# EAGLE design ArduinoLFO_Output_Board (EAGLE 8.7.0)
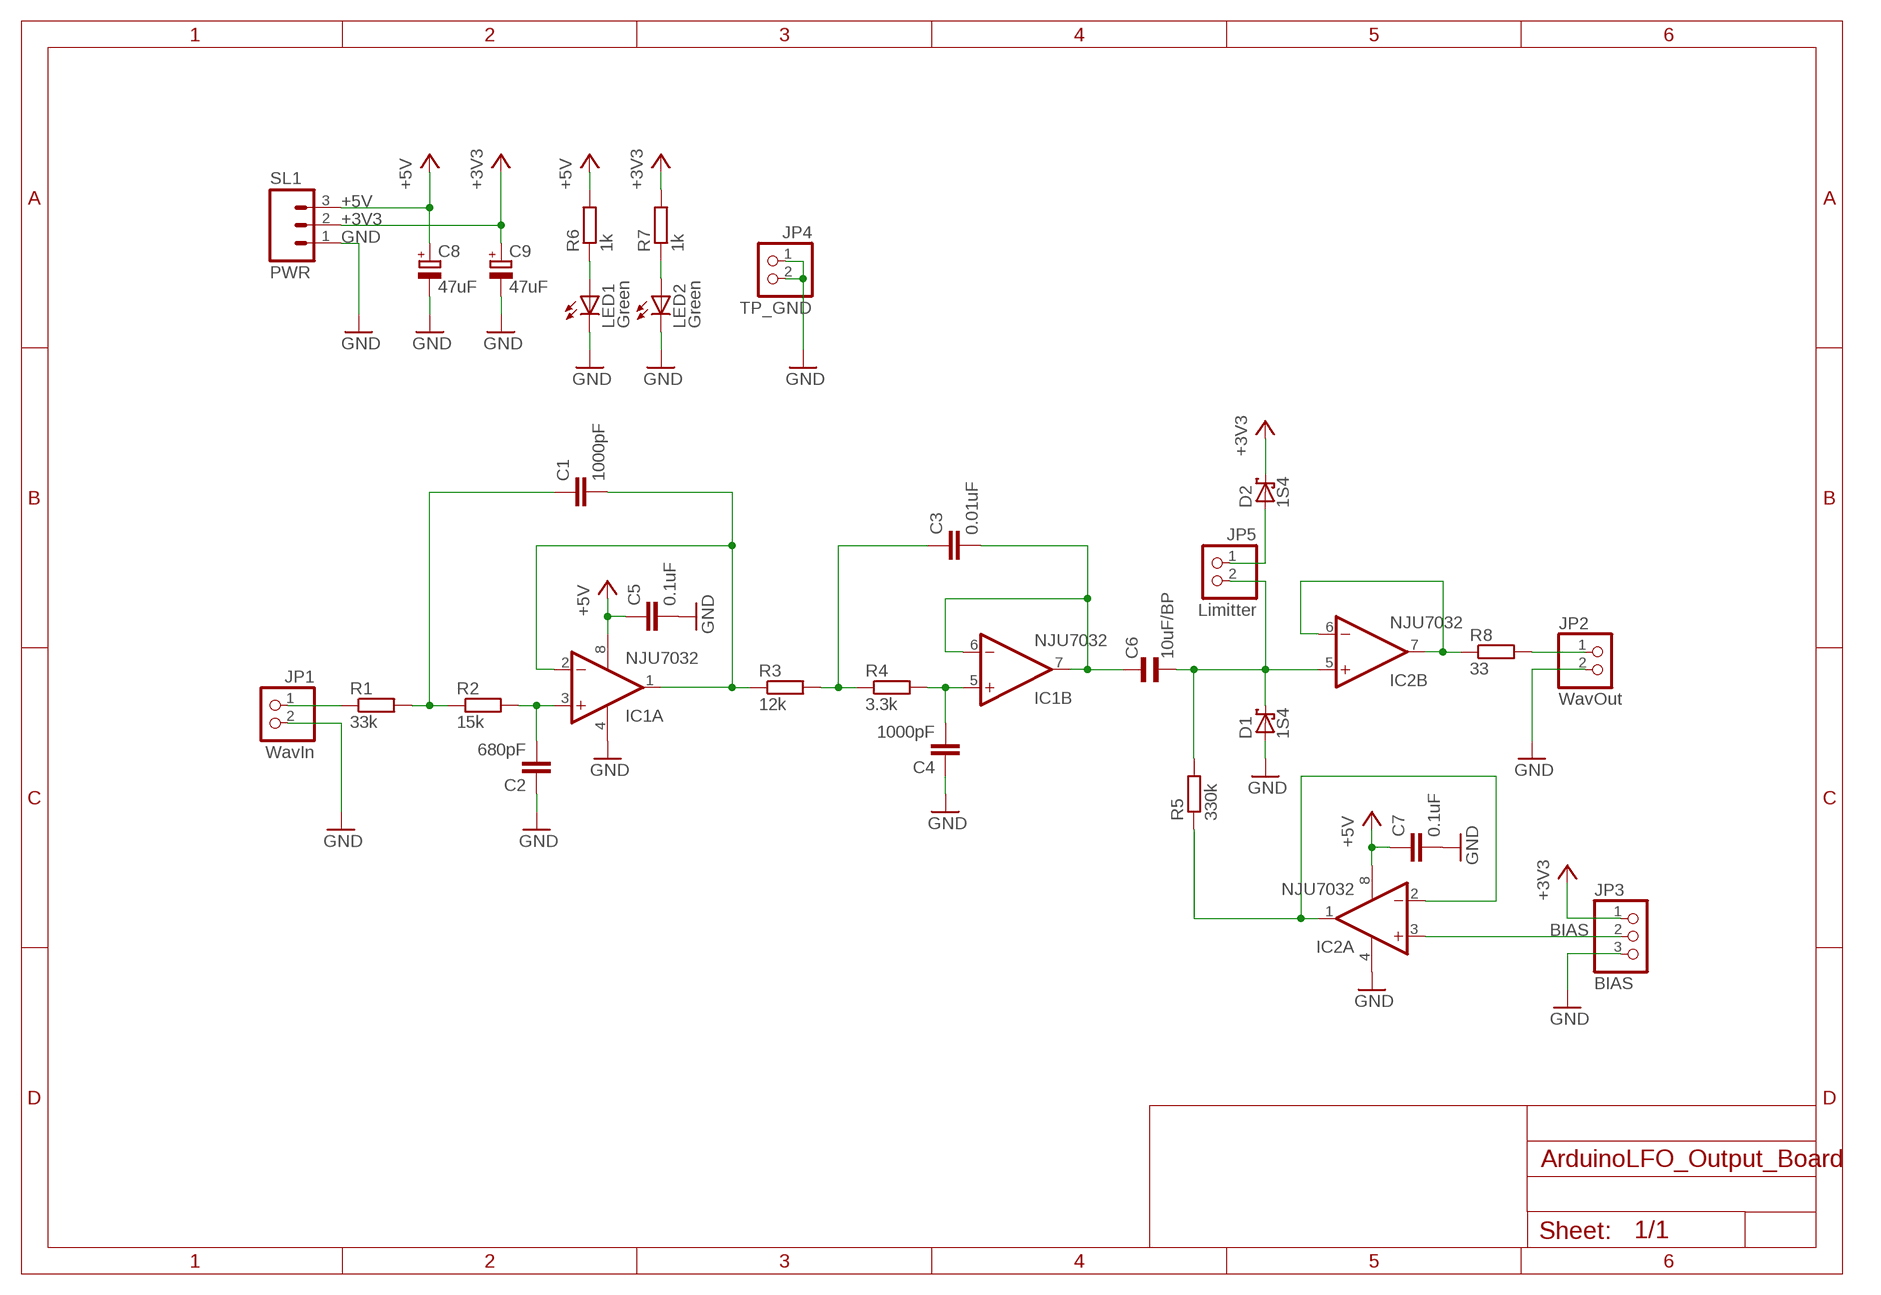
[diagram p0: schematic, sheet 1]

## Parts
C1  1000pF  C-EU050-025X075  [C050-025X075]
C2  680pF  C-EU050-030X075  [C050-030X075]
C3  0.01uF  C-EU050-025X075  [C050-025X075]
C4  1000pF  C-EU050-025X075  [C050-025X075]
C5  0.1uF  C-EU025-024X044  [C025-024X044]
C6  10uF/BP  C_BP-E5-8.5  [E5-8,5]
C7  0.1uF  C-EU025-024X044  [C025-024X044]
C8  47uF  CPOL-EUE2.5-6  [E2,5-6]
C9  47uF  CPOL-EUE2.5-6  [E2,5-6]
D1  1S4  SCHOTTKY-DIODEDO35-7  [DO35-7]
D2  1S4  SCHOTTKY-DIODEDO35-7  [DO35-7]
IC1  NJU7032  LM358N  [DIL08]
IC2  NJU7032  LM358N  [DIL08]
JP1  WavIn  PINHD-1X2  [1X02]
JP2  WavOut  PINHD-1X2  [1X02]
JP3  BIAS  PINHD-1X3  [1X03]
JP4  TP_GND  PINHD-1X2  [1X02]
JP5  Limitter  PINHD-1X2  [1X02]
LED1  Green  LED3MM  [LED3MM]
LED2  Green  LED3MM  [LED3MM]
R1  33k  R-EU_0207/7  [0207/7]
R2  15k  R-EU_0207/7  [0207/7]
R3  12k  R-EU_0207/7  [0207/7]
R4  3.3k  R-EU_0207/7  [0207/7]
R5  330k  R-EU_0207/7  [0207/7]
R6  1k  R-EU_0207/7  [0207/7]
R7  1k  R-EU_0207/7  [0207/7]
R8  33  R-EU_0207/7  [0207/7]
SL1  PWR  AMP-EI-M3  [03PA]

## Nets
+3V3: C9.+ D2.C JP3.1 R7.2 SL1.2
+5V: C5.1 C7.1 C8.+ IC1.8(P:V+) IC2.8(P:V+) R6.2 SL1.3
BIAS: IC2.3(A:+IN) JP3.2
GND: C2.1 C4.1 C5.2 C7.2 C8.- C9.- D1.A IC1.4(P:V-) IC2.4(P:V-) JP1.2 JP2.2 JP3.3 JP4.1 JP4.2 LED1.K(C) LED2.K(C) SL1.1
N$1: JP1.1 R1.1
N$2: C1.1 R1.2 R2.1
N$3: C2.2 IC1.3(A:+IN) R2.2
N$4: C1.2 IC1.1(A:OUT) IC1.2(A:-IN) R3.1
N$5: C3.1 R3.2 R4.1
N$6: C4.2 IC1.5(B:+IN) R4.2
N$7: C3.2 C6.1 IC1.6(B:-IN) IC1.7(B:OUT)
N$8: C6.2 D1.C IC2.5(B:+IN) JP5.2 R5.2
N$9: IC2.6(B:-IN) IC2.7(B:OUT) R8.1
N$10: IC2.1(A:OUT) IC2.2(A:-IN) R5.1
N$11: JP2.1 R8.2
N$12: LED1.A R6.1
N$13: LED2.A R7.1
N$14: D2.A JP5.1

## Library data of the parts
C1-C5 C7 = rcl:C-EU: CAPACITOR, European symbol; SPICEPREFIX: C
C6 = mylib2:C_BP-E5-8.5: Bipolar Capacitor Φ8.5
C8 C9 = rcl:CPOL-EU: POLARIZED CAPACITOR, European symbol; SPICEPREFIX: C
D1 D2 = diode:SCHOTTKY-DIODE: Schottky Diode
IC1 IC2 = linear:LM358: OP AMP also LM158; LM258; LM2904 Source: http://cache.national.com/ds/LM/LM158.pdf
JP1 JP2 JP4 JP5 = pinhead:PINHD-1X2: PIN HEADER
JP3 = pinhead:PINHD-1X3: PIN HEADER
LED1 LED2 = led:LED: LED OSRAM: - CHIPLED LG R971, LG N971, LY N971, LG Q971, LY Q971, LO R971, LY R971 LH N974, LH R974 LS Q976, LO Q976, LY Q976 LO Q996 - Hyper CHIPLED LW Q18S LB Q993, LB Q99A, LB R99A - SideLED LS A670, LO A670, LY A670, LG A670, LP A670 LB A673, LV A673, LT A673, LW A673 LH A674 LY A675 LS A676, LA A676, LO A676, LY A676, LW A676 LS A679, LY A679, LG A679 - Hyper Micro SIDELED® LS Y876, LA Y876, LO Y876, LY Y876 LT Y87S - SmartLED LW L88C, LW L88S LB L89C, LB L89S, LG L890 LS L89K, LO L89K, LY L89K LS L896, LA L896, LO L896, LY L896 - TOPLED LS T670, LO T670, LY T670, LG T670, LP T670 LSG T670, LSP T670, LSY T670, LOP T670, LYG T670 LG T671, LOG T671, LSG T671 LB T673, LV T673, LT T673, LW T673 LH T674 LS T676, LA T676, LO T676, LY T676, LB T676, LH T676, LSB T676, LW T676 LB T67C, LV T67C, LT T67C, LS T67K, LO T67K, LY T67K, LW E67C LS E67B, LA E67B, LO E67B, LY E67B, LB E67C, LV E67C, LT E67C LW T67C LS T679, LY T679, LG T679 LS T770, LO T770, LY T770, LG T770, LP T770 LB T773, LV T773, LT T773, LW T773 LH T774 LS E675, LA E675, LY E675, LS T675 LS T776, LA T776, LO T776, LY T776, LB T776 LHGB T686 LT T68C, LB T68C - Hyper Mini TOPLED® LB M676 - Mini TOPLED Santana® LG M470 LS M47K, LO M47K, LY M47K Source: http://www.osram.convergy.de LUXEON: - LUMILED® LXK2-PW12-R00, LXK2-PW12-S00, LXK2-PW14-U00, LXK2-PW14-V00 LXK2-PM12-R00, LXK2-PM12-S00, LXK2-PM14-U00 LXK2-PE12-Q00, LXK2-PE12-R00, LXK2-PE12-S00, LXK2-PE14-T00, LXK2-PE14-U00 LXK2-PB12-K00, LXK2-PB12-L00, LXK2-PB12-M00, LXK2-PB14-N00, LXK2-PB14-P00, LXK2-PB14-Q00 LXK2-PR12-L00, LXK2-PR12-M00, LXK2-PR14-Q00, LXK2-PR14-R00 LXK2-PD12-Q00, LXK2-PD12-R00, LXK2-PD12-S00 LXK2-PH12-R00, LXK2-PH12-S00 LXK2-PL12-P00, LXK2-PL12-Q00, LXK2-PL12-R00 Source: www.luxeon.com KINGBRIGHT: KA-3528ASYC Source: www.kingbright.com
R1-R8 = rcl:R-EU_: RESISTOR, European symbol; SPICEPREFIX: R
SL1 = mylib2:AMP-EI-M3: AMP EI 3P L型

## Board
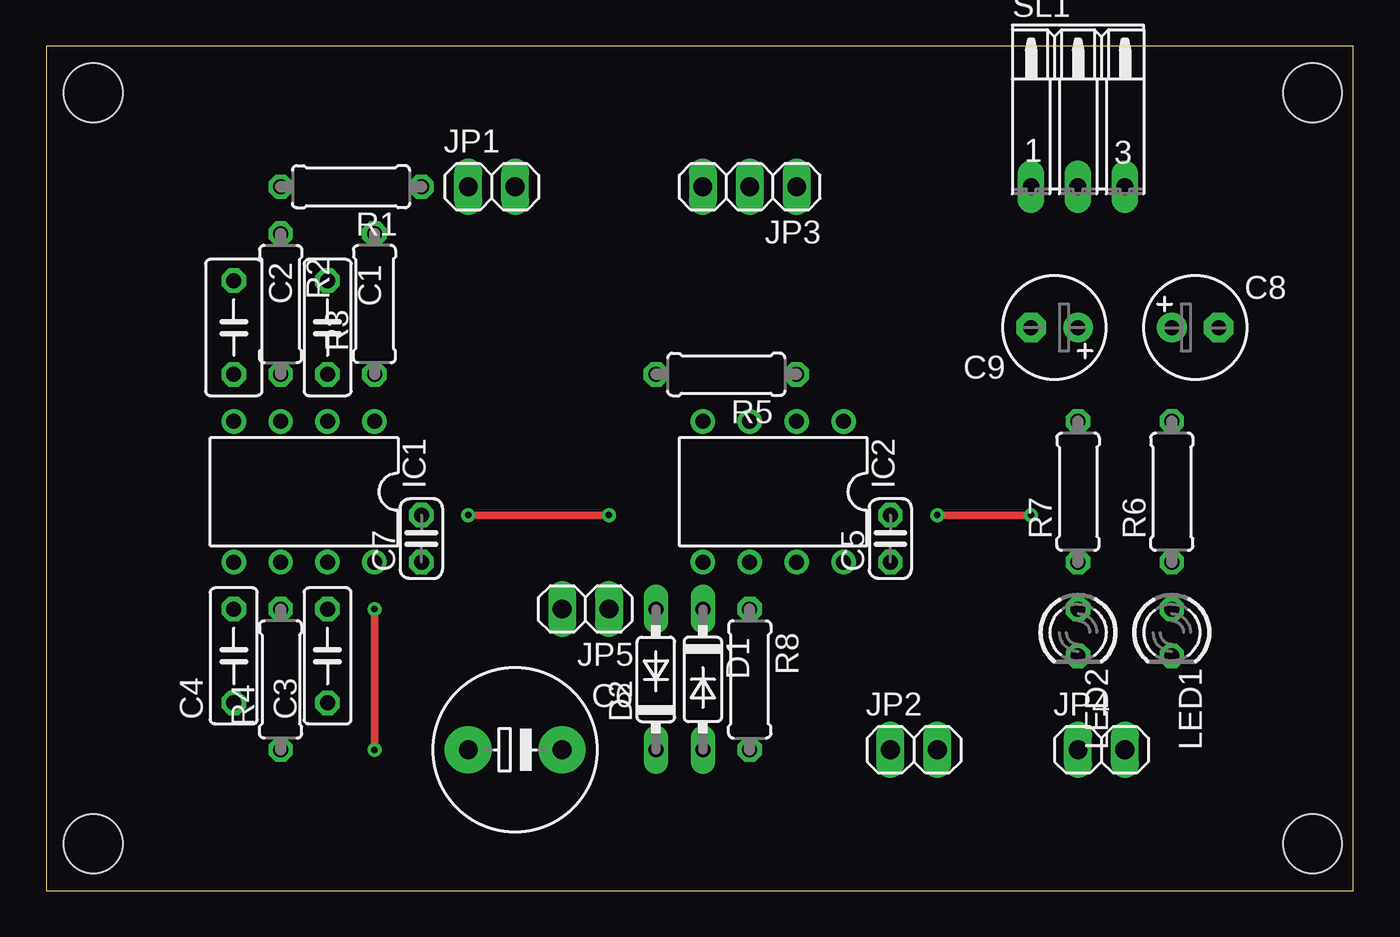
[diagram p1: board, top side]
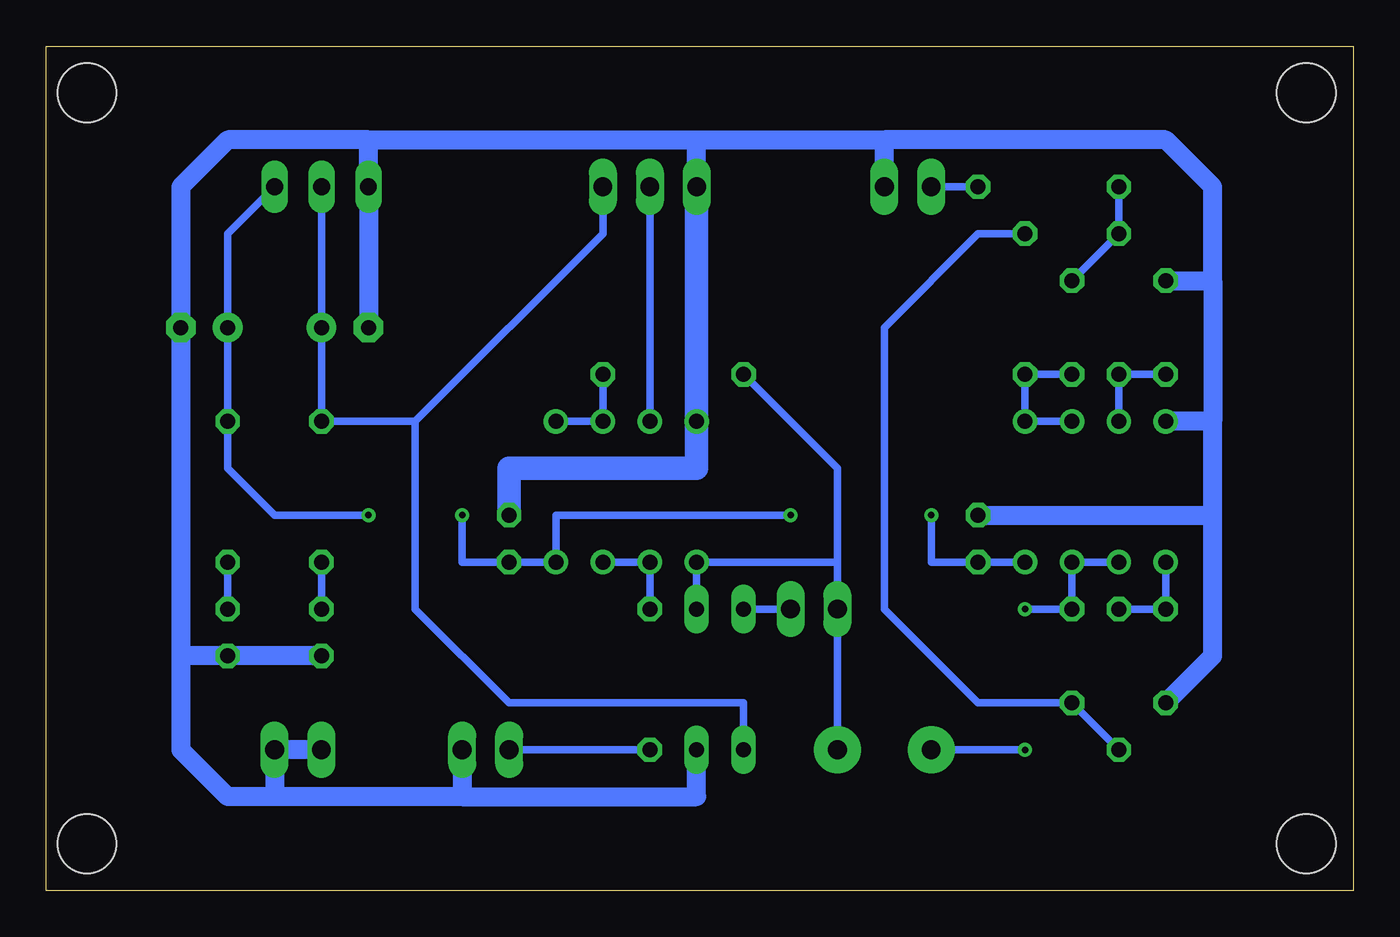
[diagram p2: board, bottom side, seen from below]

Size 70.79 x 45.71 mm. Coordinates in mm from the lower left corner, seen from the top.
Outline: 0,0 70.79,0 70.79,45.71 0,45.71 0,0
Copper layers (1*16): Top 0.035mm / dielectric 1.5mm / Bottom 0.035mm
Design rules "default": minimum track width 6mil, minimum drill 0.35mm, track to track 6mil, track to pad 6mil, pad to pad 6mil, via to via 6mil, smd to smd 6mil, copper to edge 40mil, drill to drill 6mil, minimum pad ring 10mil, minimum via ring 8mil, stop-mask expansion 4mil, vias tented up to drill 0mil, thermal gap 10mil
Holes 3.2 mm at 2.54,43.18 2.54,2.54 68.58,2.54 68.58,43.18

### Footprints (pad centres in the part's own frame; a part is rotated, then mirrored left to right if it is on the bottom)
C050-025X075 = drill 0.813 octagon: 1 -2.54,0; 2 2.54,0
C050-030X075 = drill 0.813 octagon: 1 -2.54,0; 2 2.54,0
C025-024X044 = drill 0.813 octagon: 1 -1.27,0; 2 1.27,0
E5-8,5 = drill 1.016 pad 2.54: 1 -2.54,0; 2 2.54,0
E2,5-6 = drill 0.813 pad 1.6: + -1.27,0 | drill 0.813 pad 1.6 octagon: - 1.27,0
DO35-7 = drill 0.813 long: A 3.81,0; C -3.81,0
DIL08 = drill 0.813 pad 1.27: 1 -3.81,-3.81; 2 -1.27,-3.81; 3 1.27,-3.81; 4 3.81,-3.81; 5 3.81,3.81; 6 1.27,3.81; 7 -1.27,3.81; 8 -3.81,3.81
1X02 = drill 1.016 long: 1 -1.27,0; 2 1.27,0
1X03 = drill 1.016 long: 1 -2.54,0; 2 0,0; 3 2.54,0
LED3MM = drill 0.813 octagon: A -1.27,0; K 1.27,0
0207/7 = drill 0.813 octagon: 1 -3.81,0; 2 3.81,0
03PA = drill 0.914 long: 1 -2.54,0; 2 0,0; 3 2.54,0

### Placement (x,y rotation side)
C1  15.24,30.48 270 top
C2  10.16,30.48 270 top
C3  15.24,12.7 90 top
C4  10.16,12.7 90 top
C5  45.72,19.05 90 top
C6  25.4,7.62 0 top
C7  20.32,19.05 90 top
C8  62.23,30.48 0 top
C9  54.61,30.48 180 top
D1  35.56,11.43 270 top
D2  33.02,11.43 90 top
IC1  13.97,21.59 180 top
IC2  39.37,21.59 180 top
JP1  24.13,38.1 0 top
JP2  46.99,7.62 0 top
JP3  38.1,38.1 180 top
JP4  57.15,7.62 0 top
JP5  29.21,15.24 180 top
LED1  60.96,13.97 270 top
LED2  55.88,13.97 270 top
R1  16.51,38.1 180 top
R2  12.7,31.75 270 top
R3  17.78,31.75 90 top
R4  12.7,11.43 90 top
R5  36.83,27.94 180 top
R6  60.96,21.59 90 top
R7  55.88,21.59 90 top
R8  38.1,11.43 270 top
SL1  55.88,38.1 0 top

### Tracks (layer width: path | path; a pad name or v marks a point on that pad's centre or on a via)
+3V3
  Bottom 0.406: SL1.2 C9.+ R7.2 50.8,25.4 | D2.C 33.02,10.16 45.72,10.16 50.8,15.24 50.8,25.4 | JP3.1 40.64,35.56 50.8,25.4
+5V  (via drill 0.35)
  Top 0.406: v30.48,20.32 v22.86,20.32 | v53.34,20.32 v48.26,20.32
  Bottom 0.406: IC1.8 C7.1 22.86,17.78 v22.86,20.32 | v30.48,20.32 43.18,20.32 IC2.8 C5.1 48.26,17.78 v48.26,20.32 | SL1.3 60.96,35.56 C8.+ R6.2 60.96,22.86 58.42,20.32 v53.34,20.32
BIAS
  Bottom 0.406: JP3.2 IC2.3
GND
  Bottom 1.016: JP1.2 25.4,40.64 | 7.62,33.02 7.62,25.4 | 7.62,25.4 IC1.4 | C2.1 7.62,33.02 | 7.62,20.32 7.62,25.4 | C7.2 7.62,20.32 | JP3.3 35.56,40.64 | 35.56,40.64 25.4,40.64 | 53.34,40.64 SL1.1 C9.- | 53.34,40.64 35.56,40.64 | 63.5,12.7 C8.- 63.5,38.1 60.96,40.64 53.34,40.64 | 63.5,12.7 63.5,7.62 60.96,5.08 58.42,5.08 | 48.26,5.08 35.56,5.08 D1.A | JP2.2 48.26,5.08 | LED2.K LED1.K 63.5,12.7 | JP4.1 JP4.2 58.42,5.08 | 7.62,33.02 7.62,38.1 10.16,40.64 25.4,40.64 | C4.1 7.62,12.7 7.62,20.32 | 48.26,5.08 58.42,5.08
  Bottom 1.27: JP3.3 IC2.4 35.56,22.86 45.72,22.86 C5.2
N$1
  Bottom 0.406: JP1.1 R1.1
N$2
  Bottom 0.406: R1.2 R2.1 C1.1
N$3
  Bottom 0.406: IC1.3 R2.2 C2.2
N$4
  Bottom 0.406: IC1.2 IC1.1 R3.1 C1.2
N$5
  Bottom 0.406: R4.1 C3.1 20.32,10.16 25.4,15.24 25.4,30.48 20.32,35.56 R3.2
N$6
  Bottom 0.406: IC1.5 C4.2 R4.2
N$7  (via drill 0.35)
  Top 0.406: v17.78,7.62 v17.78,15.24
  Bottom 0.406: IC1.6 IC1.7 C3.2 v17.78,15.24 | C6.1 v17.78,7.62
N$8
  Bottom 0.406: D1.C IC2.5 27.94,17.78 | 27.94,17.78 JP5.2 C6.2 | 27.94,17.78 27.94,22.86 R5.2
N$9
  Bottom 0.406: IC2.7 IC2.6 R8.1
N$10
  Bottom 0.406: R5.1 IC2.2 IC2.1
N$11
  Bottom 0.406: JP2.1 R8.2
N$12
  Bottom 0.406: R6.1 LED1.A
N$13
  Bottom 0.406: R7.1 LED2.A
N$14
  Bottom 0.406: JP5.1 D2.A